# EAGLE schematic axoloti core v3 (EAGLE 6.2)
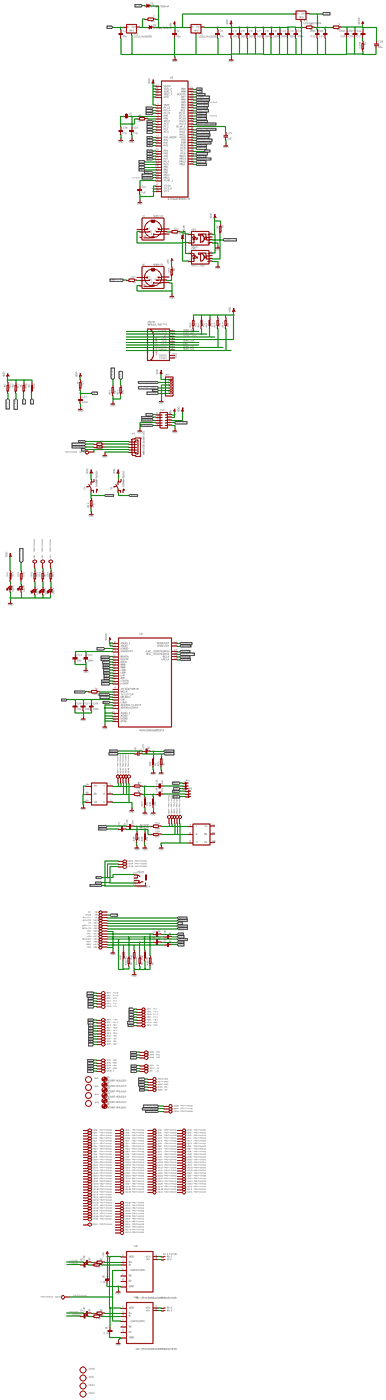
[diagram p0: schematic, sheet 1, overview]
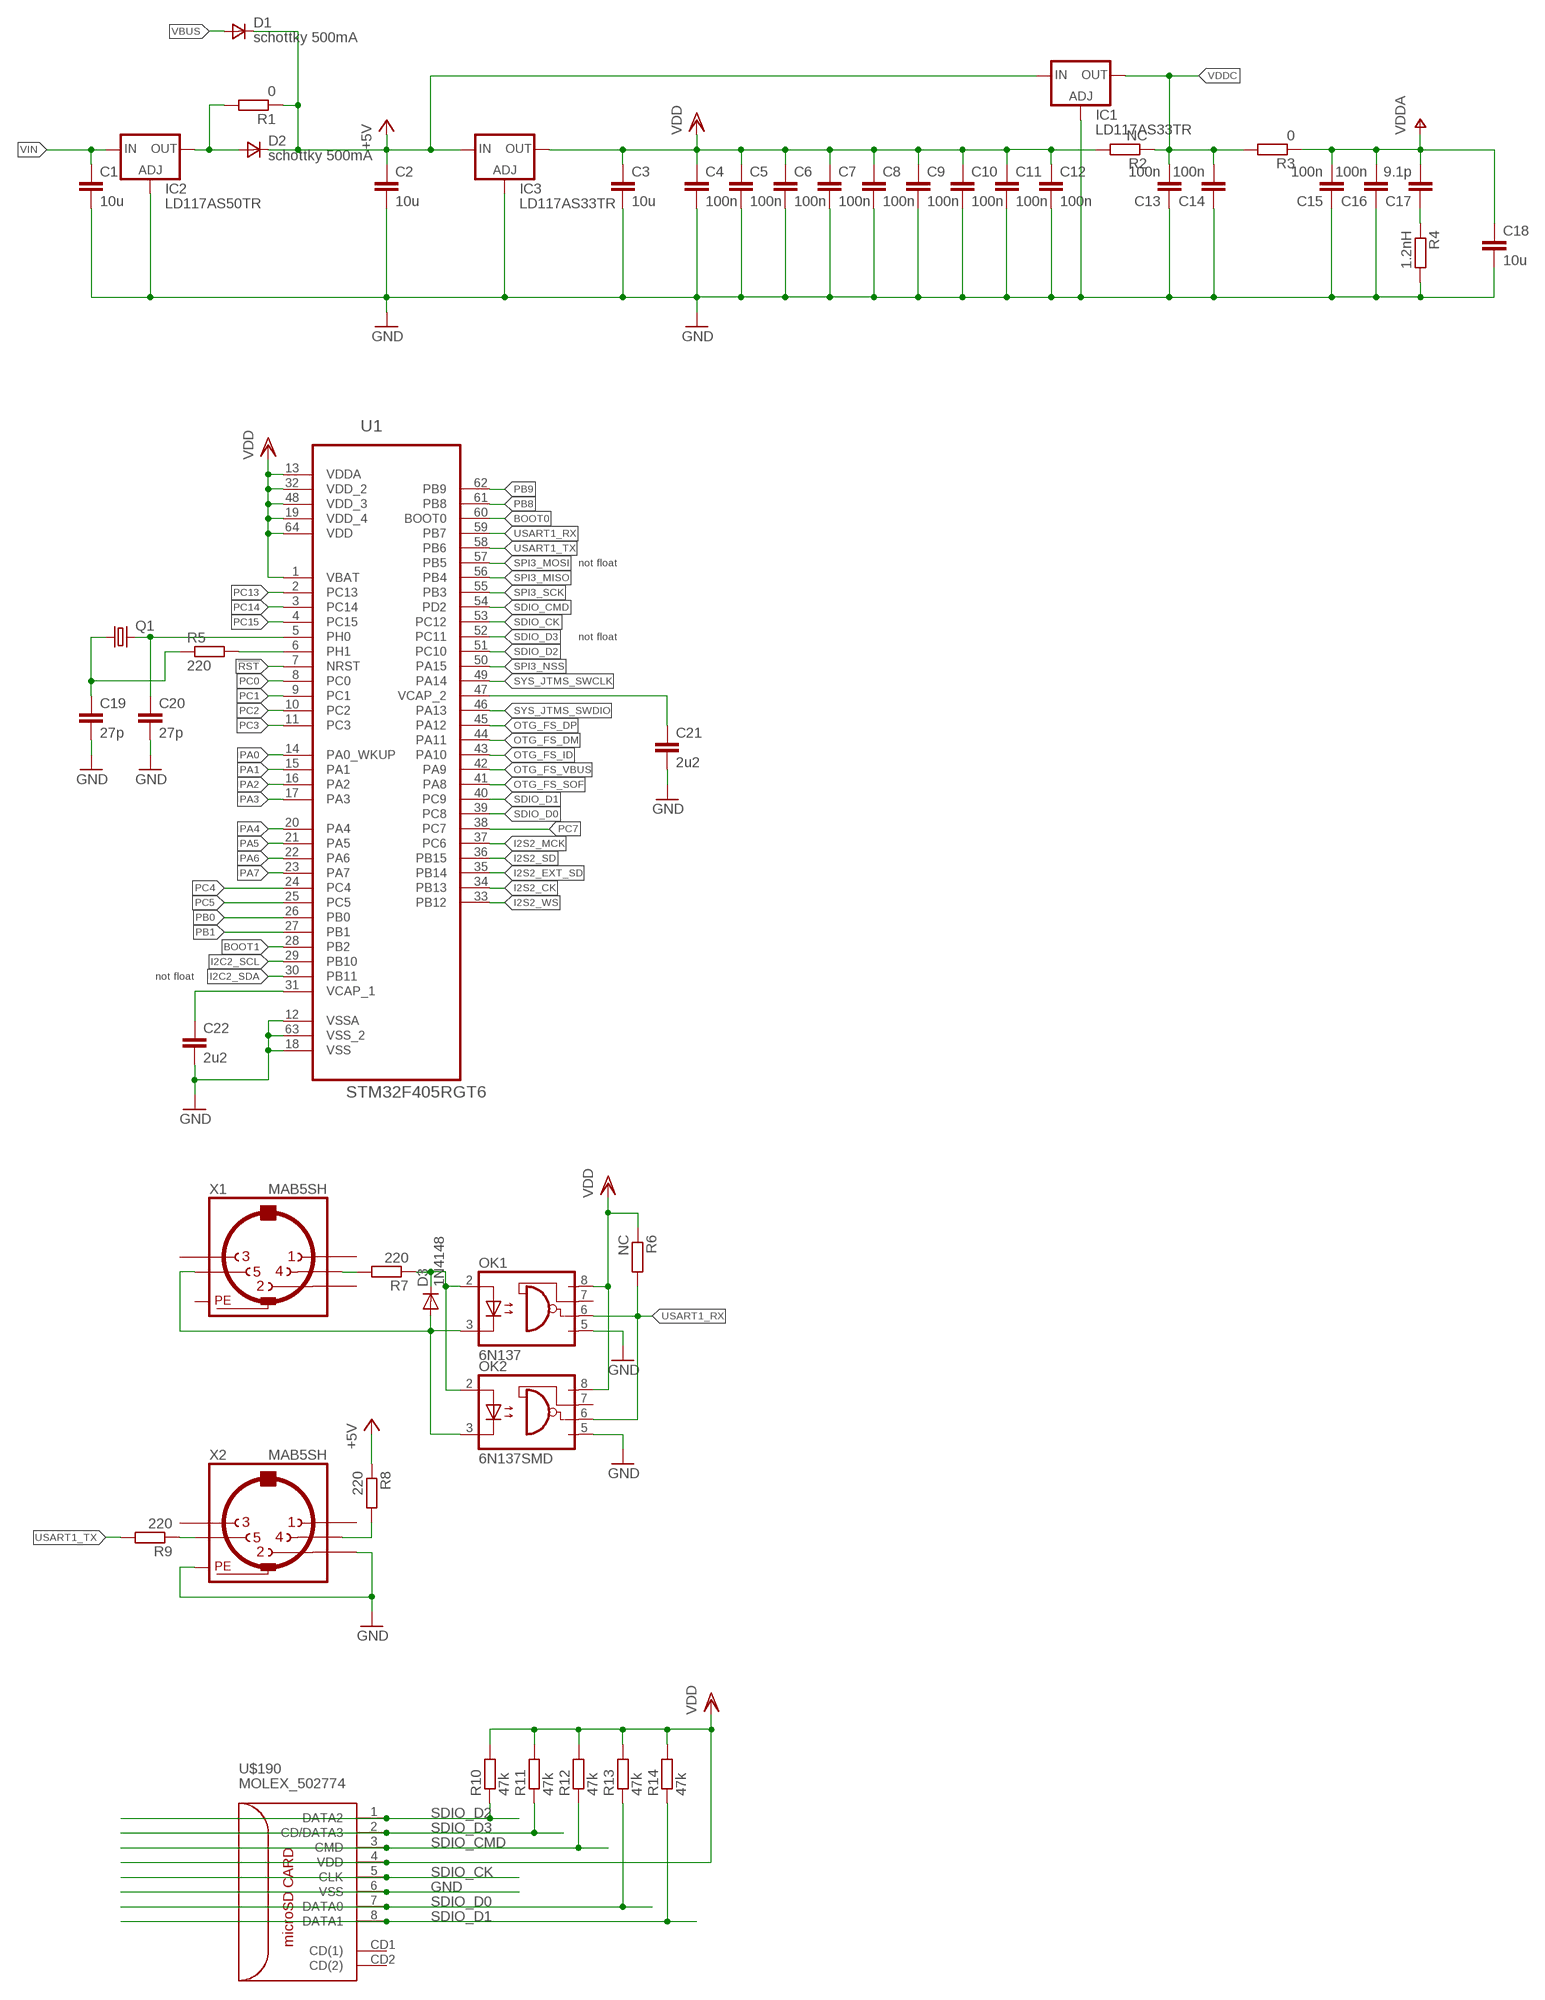
[diagram p1: schematic, sheet 1, part 1 of 4]
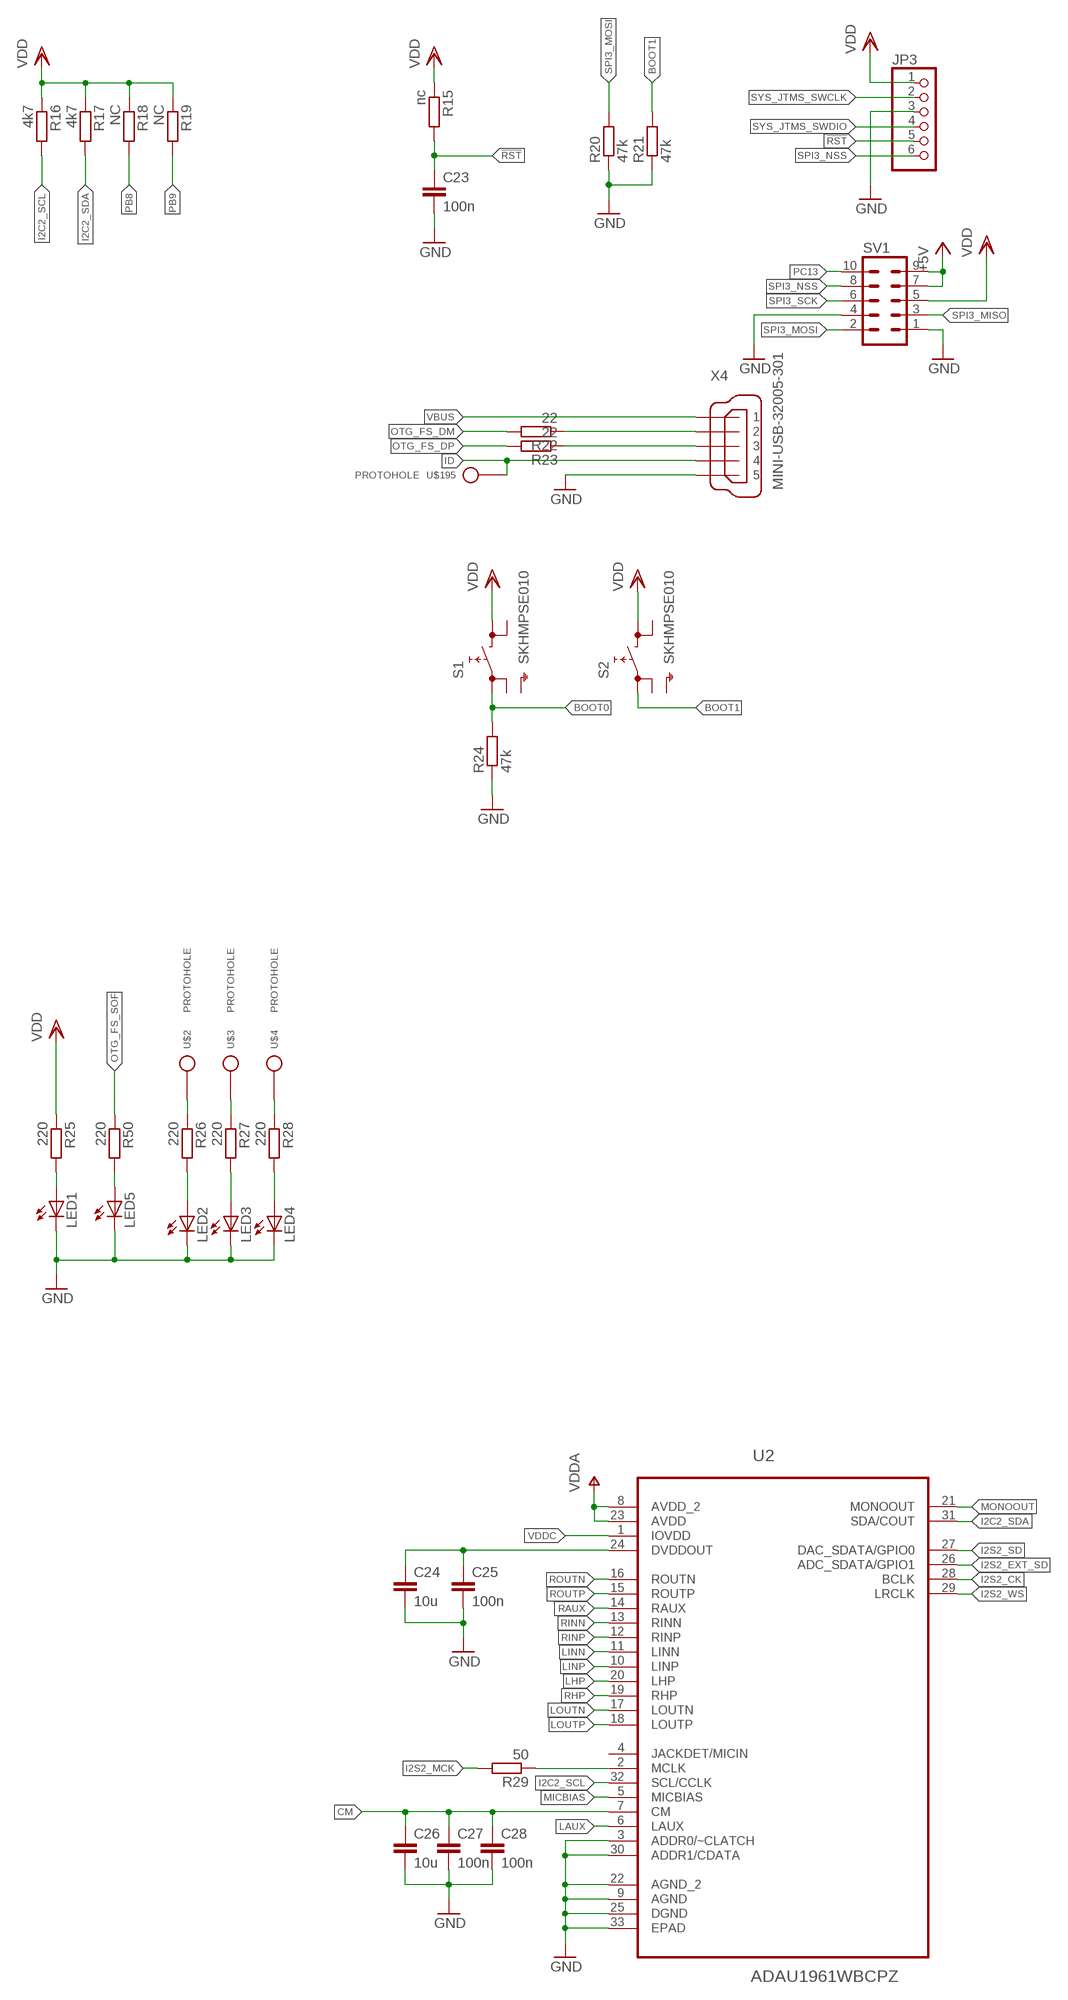
[diagram p2: schematic, sheet 1, part 2 of 4]
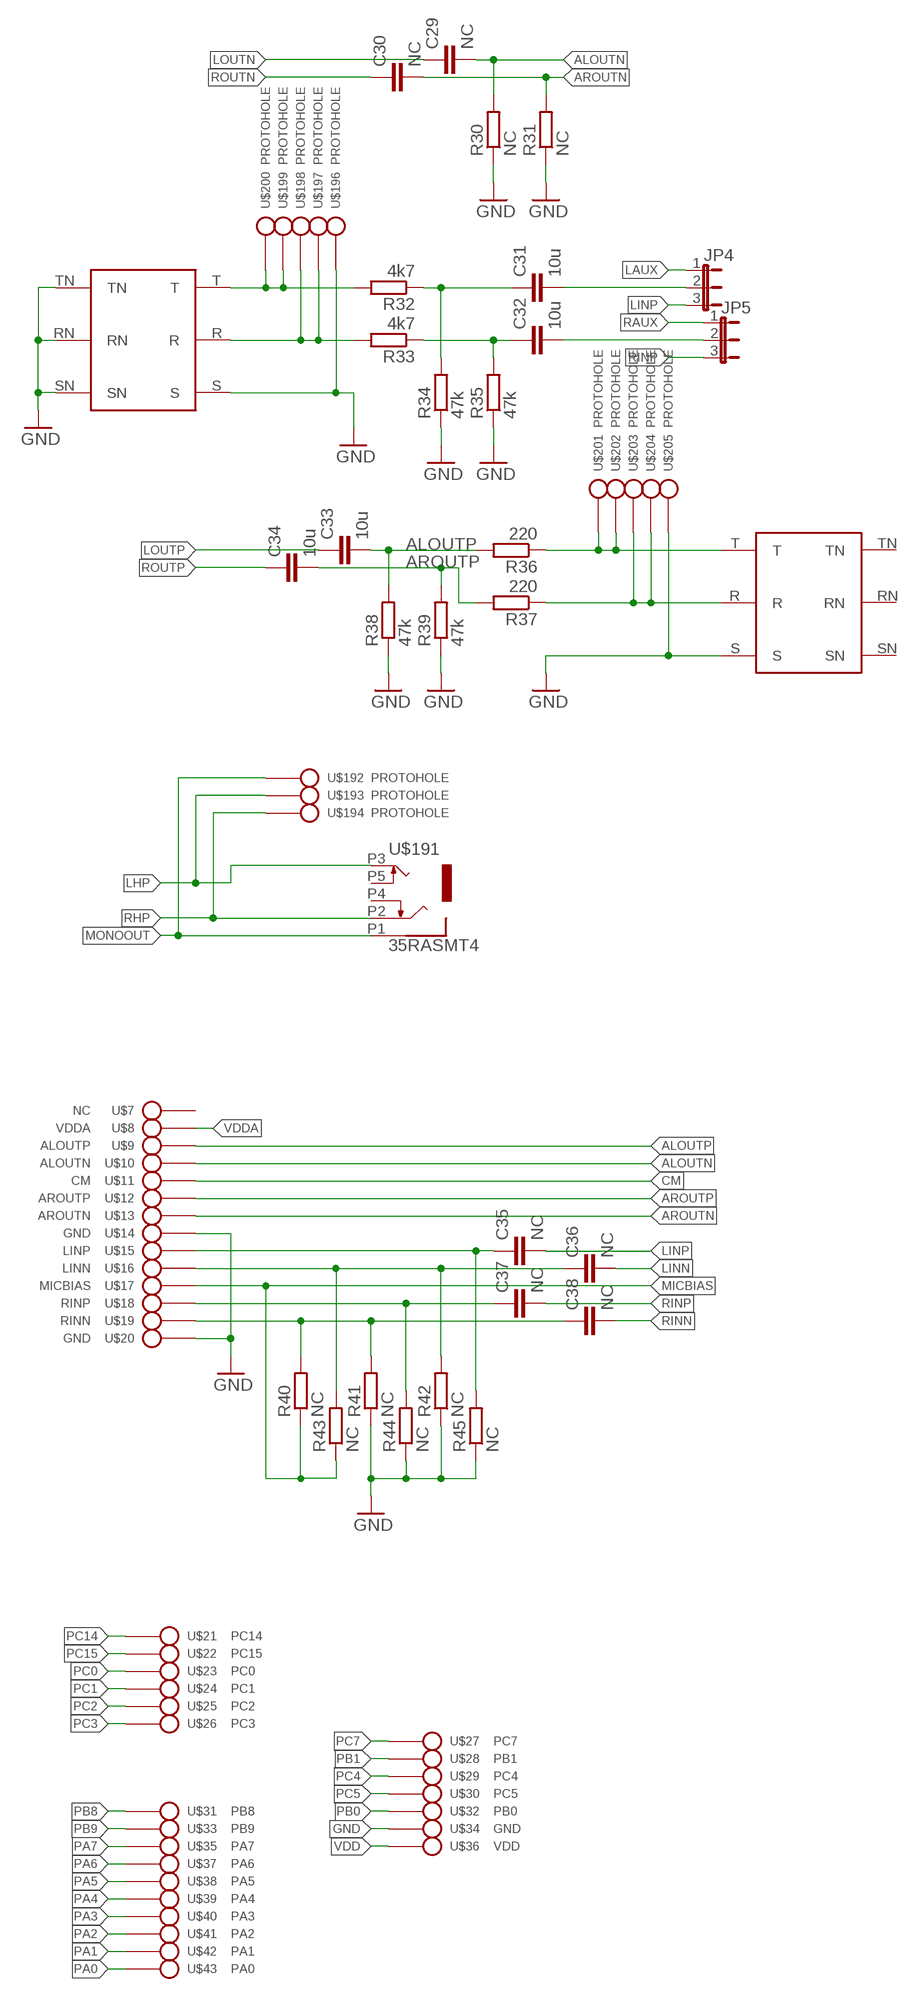
[diagram p3: schematic, sheet 1, part 3 of 4]
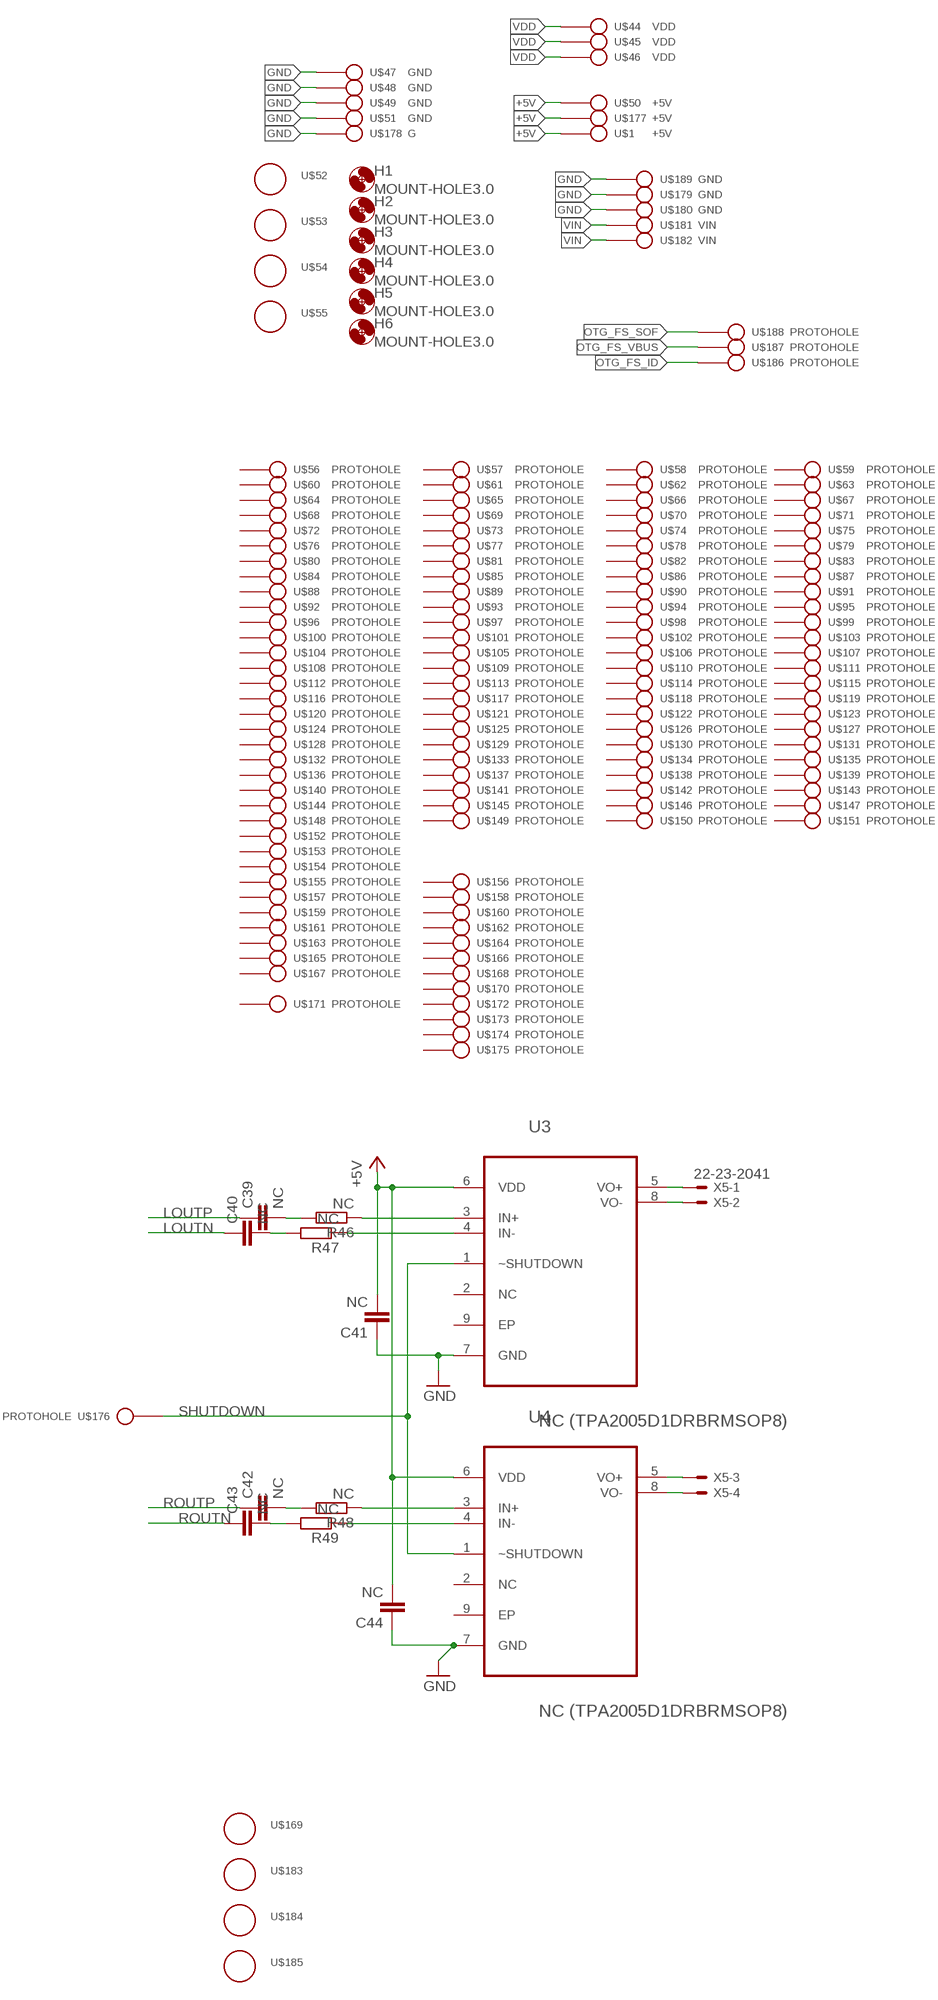
[diagram p4: schematic, sheet 1, part 4 of 4]

## Parts
C1  10u  C-EUC0805  [C0805]
C2  10u  C-EUC0805  [C0805]
C3  10u  C-EUC0805  [C0805]
C4  100n  C-EUC0603  [C0603]
C5  100n  C-EUC0603  [C0603]
C6  100n  C-EUC0603  [C0603]
C7  100n  C-EUC0603  [C0603]
C8  100n  C-EUC0603  [C0603]
C9  100n  C-EUC0603  [C0603]
C10  100n  C-EUC0603  [C0603]
C11  100n  C-EUC0603  [C0603]
C12  100n  C-EUC0603  [C0603]
C13  100n  C-EUC0603  [C0603]
C14  100n  C-EUC0603  [C0603]
C15  100n  C-EUC0603  [C0603]
C16  100n  C-EUC0603  [C0603]
C17  9.1p  C-EUC0603  [C0603]
C18  10u  C-EUC0805  [C0805]
C19  27p  C-EUC0603  [C0603]
C20  27p  C-EUC0603  [C0603]
C21  2u2  C-EUC0603  [C0603]
C22  2u2  C-EUC0603  [C0603]
C23  100n  C-EUC0603  [C0603]
C24  10u  C-EUC0805  [C0805]
C25  100n  C-EUC0603  [C0603]
C26  10u  C-EUC0805  [C0805]
C27  100n  C-EUC0603  [C0603]
C28  100n  C-EUC0603  [C0603]
C29  NC  C-EUC0805  [C0805]
C30  NC  C-EUC0805  [C0805]
C31  10u  C-EUC0805  [C0805]
C32  10u  C-EUC0805  [C0805]
C33  10u  C-EUC0805  [C0805]
C34  10u  C-EUC0805  [C0805]
C35  NC  C-EUC0805  [C0805]
C36  NC  C-EUC0805  [C0805]
C37  NC  C-EUC0805  [C0805]
C38  NC  C-EUC0805  [C0805]
C39  NC  C-EUC0603  [C0603]
C40  NC  C-EUC0603  [C0603]
C41  NC  C-EUC0603  [C0603]
C42  NC  C-EUC0603  [C0603]
C43  NC  C-EUC0603  [C0603]
C44  NC  C-EUC0603  [C0603]
D1  schottky 500mA  DSOD323  [SOD323]
D2  schottky 500mA  DSOD323  [SOD323]
D3  1N4148  DIODE-SOD323-W  [SOD323-W]
H1  MOUNT-HOLE3.0  [3,0]
H2  MOUNT-HOLE3.0  [3,0]
H3  MOUNT-HOLE3.0  [3,0]
H4  MOUNT-HOLE3.0  [3,0]
H5  MOUNT-HOLE3.0  [3,0]
H6  MOUNT-HOLE3.0  [3,0]
IC1  LD117AS33TR  [SOT223]
IC2  LD117AS50TR  [SOT223]
IC3  LD117AS33TR  [SOT223]
JP3  PINHD-1X6  [1X06]
JP4  JP2E  [JP2]
JP5  JP2E  [JP2]
LED1  LEDSML0603  [SML0603]
LED2  LEDSML0603  [SML0603]
LED3  LEDSML0603  [SML0603]
LED4  LEDSML0603  [SML0603]
LED5  LEDSML0603  [SML0603]
OK1  6N137  [DIL08]
OK2  6N137SMD  [DIL8-SMD]
Q1  CRYSTALSM49  [SM49]
R1  0  R-EU_R0603  [R0603]
R2  NC  R-EU_R0603  [R0603]
R3  0  R-EU_R0603  [R0603]
R4  1.2nH  R-EU_R0603  [R0603]
R5  220  R-EU_R0603  [R0603]
R6  NC  R-EU_R0603  [R0603]
R7  220  R-EU_R0603  [R0603]
R8  220  R-EU_R0603  [R0603]
R9  220  R-EU_R0603  [R0603]
R10  47k  R-EU_R0603  [R0603]
R11  47k  R-EU_R0603  [R0603]
R12  47k  R-EU_R0603  [R0603]
R13  47k  R-EU_R0603  [R0603]
R14  47k  R-EU_R0603  [R0603]
R15  nc  R-EU_R0603  [R0603]
R16  4k7  R-EU_R0603  [R0603]
R17  4k7  R-EU_R0603  [R0603]
R18  NC  R-EU_R0603  [R0603]
R19  NC  R-EU_R0603  [R0603]
R20  47k  R-EU_R0603  [R0603]
R21  47k  R-EU_R0603  [R0603]
R22  22  R-EU_R0603  [R0603]
R23  22  R-EU_R0603  [R0603]
R24  47k  R-EU_R0603  [R0603]
R25  220  R-EU_R0603  [R0603]
R26  220  R-EU_R0603  [R0603]
R27  220  R-EU_R0603  [R0603]
R28  220  R-EU_R0603  [R0603]
R29  50  R-EU_R0603  [R0603]
R30  NC  R-EU_R0603  [R0603]
R31  NC  R-EU_R0603  [R0603]
R32  4k7  R-EU_R0603  [R0603]
R33  4k7  R-EU_R0603  [R0603]
R34  47k  R-EU_R0603  [R0603]
R35  47k  R-EU_R0603  [R0603]
R36  220  R-EU_R0603  [R0603]
R37  220  R-EU_R0603  [R0603]
R38  47k  R-EU_R0603  [R0603]
R39  47k  R-EU_R0603  [R0603]
R40  NC  R-EU_R0603  [R0603]
R41  NC  R-EU_R0603  [R0603]
R42  NC  R-EU_R0603  [R0603]
R43  NC  R-EU_R0603  [R0603]
R44  NC  R-EU_R0603  [R0603]
R45  NC  R-EU_R0603  [R0603]
R46  NC  R-EU_R0603  [R0603]
R47  NC  R-EU_R0603  [R0603]
R48  NC  R-EU_R0603  [R0603]
R49  NC  R-EU_R0603  [R0603]
R50  220  R-EU_R0603  [R0603]
S1  SKHMPSE010  [SKHMPXE010]
S2  SKHMPSE010  [SKHMPXE010]
SV1  ML10  [ML10]
U1  STM32F405RGT6  [QFP50P1200X1200X160-64N]
U2  ADAU1961WBCPZ  [QFN50P500X500X100-33N]
U3  NC (TPA2005D1DRBRMSOP8)  TPA2005D1DRBRMSOP8  [MSOP8]
U4  NC (TPA2005D1DRBRMSOP8)  TPA2005D1DRBRMSOP8  [MSOP8]
U$1  +5V  PROTOHOLENAMED  [PROTOHOLE_NAMED]
U$2  PROTOHOLE  [PROTOHOLE]
U$3  PROTOHOLE  [PROTOHOLE]
U$4  PROTOHOLE  [PROTOHOLE]
U$5  JACK63  [JACK63]
U$6  JACK63  [JACK63]
U$7  NC  PROTOHOLENAMED  [PROTOHOLE_NAMED]
U$8  VDDA  PROTOHOLENAMED  [PROTOHOLE_NAMED]
U$9  ALOUTP  PROTOHOLENAMED  [PROTOHOLE_NAMED]
U$10  ALOUTN  PROTOHOLENAMED  [PROTOHOLE_NAMED]
U$11  CM  PROTOHOLENAMED  [PROTOHOLE_NAMED]
U$12  AROUTP  PROTOHOLENAMED  [PROTOHOLE_NAMED]
U$13  AROUTN  PROTOHOLENAMED  [PROTOHOLE_NAMED]
U$14  GND  PROTOHOLENAMED  [PROTOHOLE_NAMED]
U$15  LINP  PROTOHOLENAMED  [PROTOHOLE_NAMED]
U$16  LINN  PROTOHOLENAMED  [PROTOHOLE_NAMED]
U$17  MICBIAS  PROTOHOLENAMED  [PROTOHOLE_NAMED]
U$18  RINP  PROTOHOLENAMED  [PROTOHOLE_NAMED]
U$19  RINN  PROTOHOLENAMED  [PROTOHOLE_NAMED]
U$20  GND  PROTOHOLENAMED  [PROTOHOLE_NAMED]
U$21  PC14  PROTOHOLENAMED  [PROTOHOLE_NAMED]
U$22  PC15  PROTOHOLENAMED  [PROTOHOLE_NAMED]
U$23  PC0  PROTOHOLENAMED  [PROTOHOLE_NAMED]
U$24  PC1  PROTOHOLENAMED  [PROTOHOLE_NAMED]
U$25  PC2  PROTOHOLENAMED  [PROTOHOLE_NAMED]
U$26  PC3  PROTOHOLENAMED  [PROTOHOLE_NAMED]
U$27  PC7  PROTOHOLENAMED  [PROTOHOLE_NAMED]
U$28  PB1  PROTOHOLENAMED  [PROTOHOLE_NAMED]
U$29  PC4  PROTOHOLENAMED  [PROTOHOLE_NAMED]
U$30  PC5  PROTOHOLENAMED  [PROTOHOLE_NAMED]
U$31  PB8  PROTOHOLENAMED  [PROTOHOLE_NAMED]
U$32  PB0  PROTOHOLENAMED  [PROTOHOLE_NAMED]
U$33  PB9  PROTOHOLENAMED  [PROTOHOLE_NAMED]
U$34  GND  PROTOHOLENAMED  [PROTOHOLE_NAMED]
U$35  PA7  PROTOHOLENAMED  [PROTOHOLE_NAMED]
U$36  VDD  PROTOHOLENAMED  [PROTOHOLE_NAMED]
U$37  PA6  PROTOHOLENAMED  [PROTOHOLE_NAMED]
U$38  PA5  PROTOHOLENAMED  [PROTOHOLE_NAMED]
U$39  PA4  PROTOHOLENAMED  [PROTOHOLE_NAMED]
U$40  PA3  PROTOHOLENAMED  [PROTOHOLE_NAMED]
U$41  PA2  PROTOHOLENAMED  [PROTOHOLE_NAMED]
U$42  PA1  PROTOHOLENAMED  [PROTOHOLE_NAMED]
U$43  PA0  PROTOHOLENAMED  [PROTOHOLE_NAMED]
U$44  VDD  PROTOHOLENAMED  [PROTOHOLE_NAMED]
U$45  VDD  PROTOHOLENAMED  [PROTOHOLE_NAMED]
U$46  VDD  PROTOHOLENAMED  [PROTOHOLE_NAMED]
U$47  GND  PROTOHOLENAMED  [PROTOHOLE_NAMED]
U$48  GND  PROTOHOLENAMED  [PROTOHOLE_NAMED]
U$49  GND  PROTOHOLENAMED  [PROTOHOLE_NAMED]
U$50  +5V  PROTOHOLENAMED  [PROTOHOLE_NAMED]
U$51  GND  PROTOHOLENAMED  [PROTOHOLE_NAMED]
U$52  FIDUCIAL-1  [FIDUCIAL-1]
U$53  FIDUCIAL-1  [FIDUCIAL-1]
U$54  FIDUCIAL-1  [FIDUCIAL-1]
U$55  FIDUCIAL-1  [FIDUCIAL-1]
U$56  PROTOHOLE  [PROTOHOLE]
U$57  PROTOHOLE  [PROTOHOLE]
U$58  PROTOHOLE  [PROTOHOLE]
U$59  PROTOHOLE  [PROTOHOLE]
U$60  PROTOHOLE  [PROTOHOLE]
U$61  PROTOHOLE  [PROTOHOLE]
U$62  PROTOHOLE  [PROTOHOLE]
U$63  PROTOHOLE  [PROTOHOLE]
U$64  PROTOHOLE  [PROTOHOLE]
U$65  PROTOHOLE  [PROTOHOLE]
U$66  PROTOHOLE  [PROTOHOLE]
U$67  PROTOHOLE  [PROTOHOLE]
U$68  PROTOHOLE  [PROTOHOLE]
U$69  PROTOHOLE  [PROTOHOLE]
U$70  PROTOHOLE  [PROTOHOLE]
U$71  PROTOHOLE  [PROTOHOLE]
U$72  PROTOHOLE  [PROTOHOLE]
U$73  PROTOHOLE  [PROTOHOLE]
U$74  PROTOHOLE  [PROTOHOLE]
U$75  PROTOHOLE  [PROTOHOLE]
U$76  PROTOHOLE  [PROTOHOLE]
U$77  PROTOHOLE  [PROTOHOLE]
U$78  PROTOHOLE  [PROTOHOLE]
U$79  PROTOHOLE  [PROTOHOLE]
U$80  PROTOHOLE  [PROTOHOLE]
U$81  PROTOHOLE  [PROTOHOLE]
U$82  PROTOHOLE  [PROTOHOLE]
U$83  PROTOHOLE  [PROTOHOLE]
U$84  PROTOHOLE  [PROTOHOLE]
U$85  PROTOHOLE  [PROTOHOLE]
U$86  PROTOHOLE  [PROTOHOLE]
U$87  PROTOHOLE  [PROTOHOLE]
U$88  PROTOHOLE  [PROTOHOLE]
U$89  PROTOHOLE  [PROTOHOLE]
U$90  PROTOHOLE  [PROTOHOLE]
U$91  PROTOHOLE  [PROTOHOLE]
U$92  PROTOHOLE  [PROTOHOLE]
U$93  PROTOHOLE  [PROTOHOLE]
U$94  PROTOHOLE  [PROTOHOLE]
U$95  PROTOHOLE  [PROTOHOLE]
U$96  PROTOHOLE  [PROTOHOLE]
U$97  PROTOHOLE  [PROTOHOLE]
U$98  PROTOHOLE  [PROTOHOLE]
U$99  PROTOHOLE  [PROTOHOLE]
U$100  PROTOHOLE  [PROTOHOLE]
U$101  PROTOHOLE  [PROTOHOLE]
U$102  PROTOHOLE  [PROTOHOLE]
U$103  PROTOHOLE  [PROTOHOLE]
U$104  PROTOHOLE  [PROTOHOLE]
U$105  PROTOHOLE  [PROTOHOLE]
U$106  PROTOHOLE  [PROTOHOLE]
U$107  PROTOHOLE  [PROTOHOLE]
U$108  PROTOHOLE  [PROTOHOLE]
U$109  PROTOHOLE  [PROTOHOLE]
U$110  PROTOHOLE  [PROTOHOLE]
U$111  PROTOHOLE  [PROTOHOLE]
U$112  PROTOHOLE  [PROTOHOLE]
U$113  PROTOHOLE  [PROTOHOLE]
U$114  PROTOHOLE  [PROTOHOLE]
U$115  PROTOHOLE  [PROTOHOLE]
U$116  PROTOHOLE  [PROTOHOLE]
U$117  PROTOHOLE  [PROTOHOLE]
U$118  PROTOHOLE  [PROTOHOLE]
U$119  PROTOHOLE  [PROTOHOLE]
U$120  PROTOHOLE  [PROTOHOLE]
U$121  PROTOHOLE  [PROTOHOLE]
U$122  PROTOHOLE  [PROTOHOLE]
U$123  PROTOHOLE  [PROTOHOLE]
U$124  PROTOHOLE  [PROTOHOLE]
U$125  PROTOHOLE  [PROTOHOLE]
U$126  PROTOHOLE  [PROTOHOLE]
U$127  PROTOHOLE  [PROTOHOLE]
U$128  PROTOHOLE  [PROTOHOLE]
U$129  PROTOHOLE  [PROTOHOLE]
U$130  PROTOHOLE  [PROTOHOLE]
U$131  PROTOHOLE  [PROTOHOLE]
U$132  PROTOHOLE  [PROTOHOLE]
U$133  PROTOHOLE  [PROTOHOLE]
U$134  PROTOHOLE  [PROTOHOLE]
U$135  PROTOHOLE  [PROTOHOLE]
U$136  PROTOHOLE  [PROTOHOLE]
U$137  PROTOHOLE  [PROTOHOLE]
U$138  PROTOHOLE  [PROTOHOLE]
U$139  PROTOHOLE  [PROTOHOLE]
U$140  PROTOHOLE  [PROTOHOLE]
U$141  PROTOHOLE  [PROTOHOLE]
U$142  PROTOHOLE  [PROTOHOLE]
U$143  PROTOHOLE  [PROTOHOLE]
U$144  PROTOHOLE  [PROTOHOLE]
U$145  PROTOHOLE  [PROTOHOLE]
U$146  PROTOHOLE  [PROTOHOLE]
U$147  PROTOHOLE  [PROTOHOLE]
U$148  PROTOHOLE  [PROTOHOLE]
U$149  PROTOHOLE  [PROTOHOLE]
U$150  PROTOHOLE  [PROTOHOLE]
U$151  PROTOHOLE  [PROTOHOLE]
U$152  PROTOHOLE  [PROTOHOLE]
U$153  PROTOHOLE  [PROTOHOLE]
U$154  PROTOHOLE  [PROTOHOLE]
U$155  PROTOHOLE  [PROTOHOLE]
U$156  PROTOHOLE  [PROTOHOLE]
U$157  PROTOHOLE  [PROTOHOLE]
U$158  PROTOHOLE  [PROTOHOLE]
U$159  PROTOHOLE  [PROTOHOLE]
U$160  PROTOHOLE  [PROTOHOLE]
U$161  PROTOHOLE  [PROTOHOLE]
U$162  PROTOHOLE  [PROTOHOLE]
U$163  PROTOHOLE  [PROTOHOLE]
U$164  PROTOHOLE  [PROTOHOLE]
U$165  PROTOHOLE  [PROTOHOLE]
U$166  PROTOHOLE  [PROTOHOLE]
U$167  PROTOHOLE  [PROTOHOLE]
U$168  PROTOHOLE  [PROTOHOLE]
U$169  FIDUCIAL-1  [FIDUCIAL-1]
U$170  PROTOHOLE  [PROTOHOLE]
U$171  PROTOHOLE  [PROTOHOLE]
U$172  PROTOHOLE  [PROTOHOLE]
U$173  PROTOHOLE  [PROTOHOLE]
U$174  PROTOHOLE  [PROTOHOLE]
U$175  PROTOHOLE  [PROTOHOLE]
U$176  PROTOHOLE  [PROTOHOLE]
U$177  +5V  PROTOHOLENAMED  [PROTOHOLE_NAMED]
U$178  G  PROTOHOLENAMED  [PROTOHOLE_NAMED]
U$179  GND  PROTOHOLENAMED  [PROTOHOLE_NAMED]
U$180  GND  PROTOHOLENAMED  [PROTOHOLE_NAMED]
U$181  VIN  PROTOHOLENAMED  [PROTOHOLE_NAMED]
U$182  VIN  PROTOHOLENAMED  [PROTOHOLE_NAMED]
U$183  FIDUCIAL-1  [FIDUCIAL-1]
U$184  FIDUCIAL-1  [FIDUCIAL-1]
U$185  FIDUCIAL-1  [FIDUCIAL-1]
U$186  PROTOHOLE  [PROTOHOLE]
U$187  PROTOHOLE  [PROTOHOLE]
U$188  PROTOHOLE  [PROTOHOLE]
U$189  GND  PROTOHOLENAMED  [PROTOHOLE_NAMED]
U$190  MOLEX_502774  [MOLEX_502774]
U$191  35RASMT4  [35RASMT4BHNTR]
U$192  PROTOHOLE  [PROTOHOLE]
U$193  PROTOHOLE  [PROTOHOLE]
U$194  PROTOHOLE  [PROTOHOLE]
U$195  PROTOHOLE  [PROTOHOLE]
U$196  PROTOHOLE  [PROTOHOLE]
U$197  PROTOHOLE  [PROTOHOLE]
U$198  PROTOHOLE  [PROTOHOLE]
U$199  PROTOHOLE  [PROTOHOLE]
U$200  PROTOHOLE  [PROTOHOLE]
U$201  PROTOHOLE  [PROTOHOLE]
U$202  PROTOHOLE  [PROTOHOLE]
U$203  PROTOHOLE  [PROTOHOLE]
U$204  PROTOHOLE  [PROTOHOLE]
U$205  PROTOHOLE  [PROTOHOLE]
X1  MAB5SH  [MAB5SH]
X2  MAB5SH  [MAB5SH]
X4  MINI-USB-32005-301  [32005-301]
X5  22-23-2041  [22-23-2041]

## Nets
!RST: C23.1 JP3.5 R15.2 U1.7(NRST)
+5V: C2.1 C41.2 C44.2 D1.1(C) D2.1(C) IC1.3(IN) IC3.3(IN) R1.1 R8.1 SV1.7 SV1.9 U3.6(VDD) U4.6(VDD) U$1.P$1 U$50.P$1 U$177.P$1
ALOUTN: C29.2 R30.2 U$10.P$1
ALOUTP: C33.2 R36.2 R38.2 U$9.P$1
AROUTN: C30.2 R31.2 U$13.P$1
AROUTP: C34.2 R37.2 R39.2 U$12.P$1
BOOT0: R24.2 S1.1(1.1) U1.60(BOOT0)
BOOT1: R21.2 S2.1(1.1) U1.28(PB2)
CM: C26.1 C27.1 C28.1 U2.7(CM) U$11.P$1
DVDDOUT: C24.1 C25.1 U2.24(DVDDOUT)
GND: C1.2 C2.2 C3.2 C4.2 C5.2 C6.2 C7.2 C8.2 C9.2 C10.2 C11.2 C12.2 C13.1 C14.1 C15.1 C16.1 C18.2 C19.2 C20.2 C21.2 C22.2 C23.2 C24.2 C25.2 C26.2 C27.2 C28.2 C41.1 C44.1 IC1.1(ADJ) IC2.1(ADJ) IC3.1(ADJ) JP3.3 LED1.C LED2.C LED3.C LED4.C LED5.C OK1.5(GND) OK2.5(GND) R4.2 R20.1 R21.1 R24.1 R30.1 R31.1 R34.1 R35.1 R38.1 R39.1 R41.1 R42.1 R44.1 R45.1 SV1.1 SV1.4 U1.12(VSSA) U1.18(VSS) U1.63(VSS_2) U2.3(ADDR0/~CLATCH) U2.9(AGND) U2.22(AGND_2) U2.25(DGND) U2.30(ADDR1/CDATA) U2.33(EPAD) U3.7(GND) U4.7(GND) U$5.RN U$5.S U$5.SN U$5.TN U$6.S U$14.P$1 U$20.P$1 U$34.P$1 U$47.P$1 U$48.P$1 U$49.P$1 U$51.P$1 U$178.P$1 U$179.P$1 U$180.P$1 U$189.P$1 U$190.6(VSS) U$196.P$1 U$205.P$1 X2.2 X2.PE X2.PE@(PE) X4.5
I2C2_SCL: R16.2 U1.29(PB10) U2.32(SCL/CCLK)
I2C2_SDA: R17.2 U1.30(PB11) U2.31(SDA/COUT)
I2S2_CK: U1.34(PB13) U2.28(BCLK)
I2S2_EXT_SD: U1.35(PB14) U2.26(ADC_SDATA/GPIO1)
I2S2_MCK: R29.2 U1.37(PC6)
I2S2_SD: U1.36(PB15) U2.27(DAC_SDATA/GPIO0)
I2S2_WS: U1.33(PB12) U2.29(LRCLK)
ID: U$195.P$1 X4.4
LAUX: JP4.1 U2.6(LAUX)
LHP: U2.20(LHP) U$191.P3(T) U$193.P$1
LINN: C36.2 U2.11(LINN)
LINP: C35.2 JP4.3 U2.10(LINP)
LOUTN: C29.1 C40.1 U2.17(LOUTN)
LOUTP: C33.1 C39.1 U2.18(LOUTP)
MICBIAS: R40.1 R43.1 U2.5(MICBIAS) U$17.P$1
MONOOUT: U2.21(MONOOUT) U$191.P1(S) U$192.P$1
N$1: LED1.A R25.2
N$2: C37.1 R44.2 U$18.P$1
N$3: C38.1 R40.2 R41.2 U$19.P$1
N$4: C36.1 R42.2 R43.2 U$16.P$1
N$5: C35.1 R45.2 U$15.P$1
N$6: R36.1 U$6.T U$201.P$1 U$202.P$1
N$7: R37.1 U$6.R U$203.P$1 U$204.P$1
N$8: R5.2 U1.6(PH1)
N$9: C17.1 R4.1
N$10: R29.1 U2.2(MCLK)
N$11: C19.1 Q1.1 R5.1
N$12: C20.1 Q1.2 U1.5(PH0)
N$13: R22.1 X4.2
N$14: R23.1 X4.3
N$15: U3.5(VO+) X5.1
N$16: U3.8(VO-) X5.2
N$17: LED5.A R50.2
N$18: D2.2(A) IC2.4(OUT) R1.2
N$20: R26.1 U$2.P$1
N$21: R27.1 U$3.P$1
N$22: R28.1 U$4.P$1
N$26: C31.2 JP4.2
N$27: U4.8(VO-) X5.4
N$28: U4.5(VO+) X5.3
N$30: R46.1 U3.3(IN+)
N$31: R47.1 U3.4(IN-)
N$32: C39.2 R46.2
N$33: C40.2 R47.2
N$34: R49.1 U4.4(IN-)
N$35: C42.2 R48.2
N$36: C43.2 R49.2
N$37: R48.1 U4.3(IN+)
N$38: D3.A OK1.3(C) OK2.3(C) X1.5
N$39: C32.2 JP5.2
N$41: R32.2 U$5.T U$199.P$1 U$200.P$1
N$42: R7.2 X1.4
N$43: R33.2 U$5.R U$197.P$1 U$198.P$1
N$44: C32.1 R33.1 R35.2
N$46: C31.1 R32.1 R34.2
N$49: LED2.A R26.2
N$50: LED3.A R27.2
N$51: LED4.A R28.2
N$61: D3.C OK1.2(A) OK2.2(A) R7.1
N$62: R8.2 X2.4
N$68: R9.1 X2.5
OTG_FS_DM: R22.2 U1.44(PA11)
OTG_FS_DP: R23.2 U1.45(PA12)
OTG_FS_ID: U1.43(PA10) U$186.P$1
OTG_FS_SOF: R50.1 U1.41(PA8) U$188.P$1
OTG_FS_VBUS: U1.42(PA9) U$187.P$1
PA0: U1.14(PA0_WKUP) U$43.P$1
PA1: U1.15(PA1) U$42.P$1
PA2: U1.16(PA2) U$41.P$1
PA3: U1.17(PA3) U$40.P$1
PA4: U1.20(PA4) U$39.P$1
PA5: U1.21(PA5) U$38.P$1
PA6: U1.22(PA6) U$37.P$1
PA7: U1.23(PA7) U$35.P$1
PB0: U1.26(PB0) U$32.P$1
PB1: U1.27(PB1) U$28.P$1
PB8: R18.2 U1.61(PB8) U$31.P$1
PB9: R19.2 U1.62(PB9) U$33.P$1
PC0: U1.8(PC0) U$23.P$1
PC1: U1.9(PC1) U$24.P$1
PC2: U1.10(PC2) U$25.P$1
PC3: U1.11(PC3) U$26.P$1
PC4: U1.24(PC4) U$29.P$1
PC5: U1.25(PC5) U$30.P$1
PC7: U1.38(PC7) U$27.P$1
PC13: SV1.10 U1.2(PC13)
PC14: U1.3(PC14) U$21.P$1
PC15: U1.4(PC15) U$22.P$1
RAUX: JP5.1 U2.14(RAUX)
RHP: U2.19(RHP) U$191.P2(R) U$194.P$1
RINN: C38.2 U2.13(RINN)
RINP: C37.2 JP5.3 U2.12(RINP)
ROUTN: C30.1 C43.1 U2.16(ROUTN)
ROUTP: C34.1 C42.1 U2.15(ROUTP)
SDIO_CK: U1.53(PC12) U$190.5(CLK)
SDIO_CMD: R12.1 U1.54(PD2) U$190.3(CMD)
SDIO_D0: R13.1 U1.39(PC8) U$190.7(DATA0)
SDIO_D1: R14.1 U1.40(PC9) U$190.8(DATA1)
SDIO_D2: R10.1 U1.51(PC10) U$190.1(DATA2)
SDIO_D3: R11.1 U1.52(PC11) U$190.2(CD/DATA3)
SHUTDOWN: U3.1(~SHUTDOWN) U4.1(~SHUTDOWN) U$176.P$1
SPI3_MISO: SV1.3 U1.56(PB4)
SPI3_MOSI: R20.2 SV1.2 U1.57(PB5)
SPI3_NSS: JP3.6 SV1.8 U1.50(PA15)
SPI3_SCK: SV1.6 U1.55(PB3)
SYS_JTMS_SWCLK: JP3.2 U1.49(PA14)
SYS_JTMS_SWDIO: JP3.4 U1.46(PA13)
USART1_RX: OK1.6(VO) OK2.6(VO) R6.2 U1.59(PB7)
USART1_TX: R9.2 U1.58(PB6)
VBUS: D1.2(A) X4.1
VCAP1: C22.1 U1.31(VCAP_1)
VCAP2: C21.1 U1.47(VCAP_2)
VDD: C3.1 C4.1 C5.1 C6.1 C7.1 C8.1 C9.1 C10.1 C11.1 C12.1 IC3.4(OUT) JP3.1 OK1.8(VCC) OK2.8(VCC) R2.2 R6.1 R10.2 R11.2 R12.2 R13.2 R14.2 R15.1 R16.1 R17.1 R18.1 R19.1 R25.1 S1.3(2.1) S2.3(2.1) SV1.5 U1.1(VBAT) U1.13(VDDA) U1.19(VDD_4) U1.32(VDD_2) U1.48(VDD_3) U1.64(VDD) U$36.P$1 U$44.P$1 U$45.P$1 U$46.P$1 U$190.4(VDD)
VDDA: C15.2 C16.2 C17.2 C18.1 R3.1 U2.8(AVDD_2) U2.23(AVDD) U$8.P$1
VDDC: C13.2 C14.2 IC1.4(OUT) R2.1 R3.2 U2.1(IOVDD)
VIN: C1.1 IC2.3(IN) U$181.P$1 U$182.P$1
Unconnected: OK1.7(VE) OK2.7(VE) S1.2(1.2) S1.4(2.2) S1.5(SH) S2.2(1.2) S2.4(2.2) S2.5(SH) U2.4(JACKDET/MICIN) U3.2(NC) U3.9(EP) U4.2(NC) U4.9(EP) U$6.RN U$6.SN U$6.TN U$7.P$1 U$56.P$1 U$57.P$1 U$58.P$1 U$59.P$1 U$60.P$1 U$61.P$1 U$62.P$1 U$63.P$1 U$64.P$1 U$65.P$1 U$66.P$1 U$67.P$1 U$68.P$1 U$69.P$1 U$70.P$1 U$71.P$1 U$72.P$1 U$73.P$1 U$74.P$1 U$75.P$1 U$76.P$1 U$77.P$1 U$78.P$1 U$79.P$1 U$80.P$1 U$81.P$1 U$82.P$1 U$83.P$1 U$84.P$1 U$85.P$1 U$86.P$1 U$87.P$1 U$88.P$1 U$89.P$1 U$90.P$1 U$91.P$1 U$92.P$1 U$93.P$1 U$94.P$1 U$95.P$1 U$96.P$1 U$97.P$1 U$98.P$1 U$99.P$1 U$100.P$1 U$101.P$1 U$102.P$1 U$103.P$1 U$104.P$1 U$105.P$1 U$106.P$1 U$107.P$1 U$108.P$1 U$109.P$1 U$110.P$1 U$111.P$1 U$112.P$1 U$113.P$1 U$114.P$1 U$115.P$1 U$116.P$1 U$117.P$1 U$118.P$1 U$119.P$1 U$120.P$1 U$121.P$1 U$122.P$1 U$123.P$1 U$124.P$1 U$125.P$1 U$126.P$1 U$127.P$1 U$128.P$1 U$129.P$1 U$130.P$1 U$131.P$1 U$132.P$1 U$133.P$1 U$134.P$1 U$135.P$1 U$136.P$1 U$137.P$1 U$138.P$1 U$139.P$1 U$140.P$1 U$141.P$1 U$142.P$1 U$143.P$1 U$144.P$1 U$145.P$1 U$146.P$1 U$147.P$1 U$148.P$1 U$149.P$1 U$150.P$1 U$151.P$1 U$152.P$1 U$153.P$1 U$154.P$1 U$155.P$1 U$156.P$1 U$157.P$1 U$158.P$1 U$159.P$1 U$160.P$1 U$161.P$1 U$162.P$1 U$163.P$1 U$164.P$1 U$165.P$1 U$166.P$1 U$167.P$1 U$168.P$1 U$170.P$1 U$171.P$1 U$172.P$1 U$173.P$1 U$174.P$1 U$175.P$1 U$190.CD1(CD(1)) U$190.CD2(CD(2)) U$191.P4(BR) U$191.P5(BT) X1.1 X1.2 X1.3 X2.1 X2.3

## Notes on the sheet
- not float
- not float
- not float

## Power pins joined to a net without a drawn wire
PE: X1.PE X1.PE@(PE)

## Library data of the parts
C1-C44 = rcl:C-EU: CAPACITOR, European symbol
D1 D2 = zetex:D: DIODE; MPN: CDSOD323-T05C; OC_FARNELL: 1824860; OC_NEWARK: 79R6078
D3 = diode:DIODE-: DIODE
H1-H6 = holes:MOUNT-HOLE: MOUNTING HOLE with drill center marker
IC1-IC3 = v-reg:LD117A?*: Low drop fixed and adjustable positive voltage regulators 1 A Source: http://www.st.com/stonline/products/literature/ds/7194/ld1117axx.pdf
JP3 = pinhead:PINHD-1X6: PIN HEADER
JP4 JP5 = jumper:JP2E: JUMPER
LED1-LED5 = led:LED: LED OSRAM: - CHIPLED LG R971, LG N971, LY N971, LG Q971, LY Q971, LO R971, LY R971 LH N974, LH R974 LS Q976, LO Q976, LY Q976 LO Q996 - Hyper CHIPLED LW Q18S LB Q993, LB Q99A, LB R99A - SideLED LS A670, LO A670, LY A670, LG A670, LP A670 LB A673, LV A673, LT A673, LW A673 LH A674 LY A675 LS A676, LA A676, LO A676, LY A676, LW A676 LS A679, LY A679, LG A679 - Hyper Micro SIDELED® LS Y876, LA Y876, LO Y876, LY Y876 LT Y87S - SmartLED LW L88C, LW L88S LB L89C, LB L89S, LG L890 LS L89K, LO L89K, LY L89K LS L896, LA L896, LO L896, LY L896 - TOPLED LS T670, LO T670, LY T670, LG T670, LP T670 LSG T670, LSP T670, LSY T670, LOP T670, LYG T670 LG T671, LOG T671, LSG T671 LB T673, LV T673, LT T673, LW T673 LH T674 LS T676, LA T676, LO T676, LY T676, LB T676, LH T676, LSB T676, LW T676 LB T67C, LV T67C, LT T67C, LS T67K, LO T67K, LY T67K, LW E67C LS E67B, LA E67B, LO E67B, LY E67B, LB E67C, LV E67C, LT E67C LW T67C LS T679, LY T679, LG T679 LS T770, LO T770, LY T770, LG T770, LP T770 LB T773, LV T773, LT T773, LW T773 LH T774 LS E675, LA E675, LY E675, LS T675 LS T776, LA T776, LO T776, LY T776, LB T776 LHGB T686 LT T68C, LB T68C - Hyper Mini TOPLED® LB M676 - Mini TOPLED Santana® LG M470 LS M47K, LO M47K, LY M47K Source: http://www.osram.convergy.de LUXEON: - LUMILED® LXK2-PW12-R00, LXK2-PW12-S00, LXK2-PW14-U00, LXK2-PW14-V00 LXK2-PM12-R00, LXK2-PM12-S00, LXK2-PM14-U00 LXK2-PE12-Q00, LXK2-PE12-R00, LXK2-PE12-S00, LXK2-PE14-T00, LXK2-PE14-U00 LXK2-PB12-K00, LXK2-PB12-L00, LXK2-PB12-M00, LXK2-PB14-N00, LXK2-PB14-P00, LXK2-PB14-Q00 LXK2-PR12-L00, LXK2-PR12-M00, LXK2-PR14-Q00, LXK2-PR14-R00 LXK2-PD12-Q00, LXK2-PD12-R00, LXK2-PD12-S00 LXK2-PH12-R00, LXK2-PH12-S00 LXK2-PL12-P00, LXK2-PL12-Q00, LXK2-PL12-R00 Source: www.luxeon.com KINGBRIGHT: KA-3528ASYC Source: www.kingbright.com
OK1 = optocoupler:6N137: MOTOROLA OPTO COUPLER; MPN: 6N137; OC_FARNELL: 1328376; OC_NEWARK: 52M1895
OK2 = axohw:6N137: MOTOROLA OPTO COUPLER
Q1 = crystal:CRYSTAL: CRYSTAL; OC_FARNELL: unknown; OC_NEWARK: unknown
R1-R50 = rcl:R-EU_: RESISTOR, European symbol
S1 S2 = switch:SKHMP*E010: 6.2 X 6.5mm TACT Switch (SMD) Source: http://www3.alps.co.jp/WebObjects/catalog.woa/PDF/E/Switch/Tact/SKHM/SKHM.PDF
SV1 = con-harting-ml:ML10: HARTING; OC_FARNELL: unknown; OC_NEWARK: unknown
U1 = axohw:STM32F405RGT6: IC, MCU, 32BIT, 1MB FLASH, 64LQFP; MPN: STM32F405RGT6; OC_FARNELL: 2064363; OC_NEWARK: 73T2329; PACKAGE: 64LQFP; SUPPLIER: STMicroelectronics
U2 = axohw:ADAU1961WBCPZ: SigmaDSP Stereo, Low Power, 96 kHz, 24-Bit Audio Codec; MPN: ADAU1961WBCPZ; OC_FARNELL: 1864676; OC_NEWARK: 18T1941; PACKAGE: QFN-32; SUPPLIER: ANALOG DEVICES
U3 U4 = msop8_amp:TPA2005D1DRBR: POWER AMPLIFIER
U$1-U$4 U$7-U$51 U$56-U$168 U$170-U$182 U$186-U$189 U$192-U$205 = axohw:PROTOHOLE
U$5 U$6 = con-jack63:JACK63
U$52-U$55 U$169 U$183-U$185 = axohw:FIDUCIAL-1
U$190 = axohw:MOLEX_502774: MOLEX - 49225-0821 - CONNECTEUR MICRO SD PUSH/PUSH REV Fabricant: MOLEX Code commande Farnell: 1366700 <http://fr.farnell.com/molex/49225-0821/connecteur-micro-sd-push-push-rev/dp/1366700?Ntt=1366700> Référence fabricant: 49225-0821
U$191 = switchcraft_smdminijackf:35RASMT4
X1 X2 = con-hirschmann:MAB5SH: Female CONNECTOR 5 pins 90 deg. with shield, horizontal (DIN 41524); OC_FARNELL: 809883; OC_NEWARK: unknown
X4 = con-cypressindustries:MINI-USB-: MINI USB-B Conector Source: www.cypressindustries.com; OC_FARNELL: unknown; OC_NEWARK: unknown
X5 = con-molex:22-23-2041: .100" (2.54mm) Center Header - 4 Pin; MF: MOLEX; MPN: 22-23-2041; OC_FARNELL: 1462920; OC_NEWARK: 38C0355